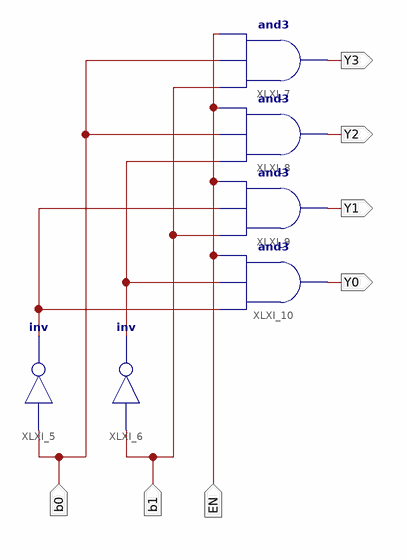
[diagram p0: schematic sheet 1]
// Xilinx ISE schematic Decoder_2to4.sch (spartan3e) as structural Verilog: 6 symbols, 7 ports
module Decoder_2to4 (
  input  b0,
  input  b1,
  input  EN,
  output Y3,
  output Y2,
  output Y1,
  output Y0
);

  wire XLXN_8, XLXN_11;

  not XLXI_5 (XLXN_8, b0);
  not XLXI_6 (XLXN_11, b1);
  and XLXI_7 (Y3, b1, b0, EN);
  and XLXI_8 (Y2, XLXN_11, b0, EN);
  and XLXI_9 (Y1, b1, XLXN_8, EN);
  and XLXI_10 (Y0, XLXN_8, XLXN_11, EN);
endmodule
